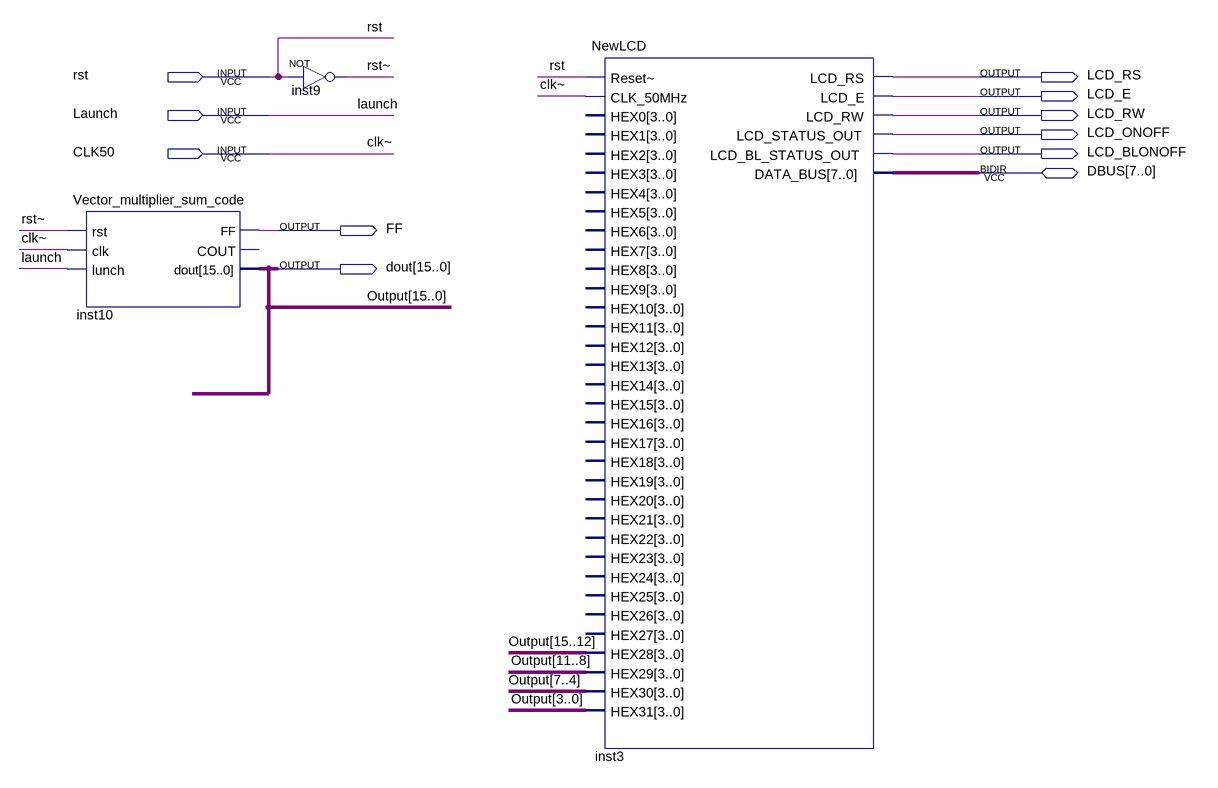
[diagram p0: schematic sheet]
// Quartus schematic Vector_multiplier_sum.bdf as structural Verilog: 3 symbols, 11 pins
module Vector_multiplier_sum (
  input  rst,
  input  Launch,
  input  CLK50,
  inout  [7:0] DBUS,
  output LCD_RS,
  output LCD_E,
  output LCD_RW,
  output LCD_ONOFF,
  output LCD_BLONOFF,
  output FF,
  output [15:0] dout
);

  wire \rst~ ;

  Vector_multiplier_sum_code inst10 (.rst(\rst~ ), .clk(CLK50), .lunch(Launch), .FF(FF), .dout(dout));  // open: COUT
  not inst9 (\rst~ , rst);
  NewLCD inst3 (
    .\Reset~ (rst), .CLK_50MHz(CLK50), .HEX28(dout[15:12]), .HEX29(dout[11:8]), .HEX30(dout[7:4]),
    .HEX31(dout[3:0]), .LCD_RS(LCD_RS), .LCD_E(LCD_E), .LCD_RW(LCD_RW), .LCD_STATUS_OUT(LCD_ONOFF),
    .LCD_BL_STATUS_OUT(LCD_BLONOFF), .DATA_BUS(DBUS));  // open: HEX0, HEX1, HEX2, HEX3, HEX4, HEX5, HEX6, HEX7, HEX8, HEX9, HEX10, HEX11, HEX12, HEX13, HEX14, HEX15, HEX16, HEX17, HEX18, HEX19, HEX20, HEX21, HEX22, HEX23, HEX24, HEX25, HEX26, HEX27

  // Other names for the same wires on the sheet: clk~ = CLK50; Output[15:0] = dout
endmodule
